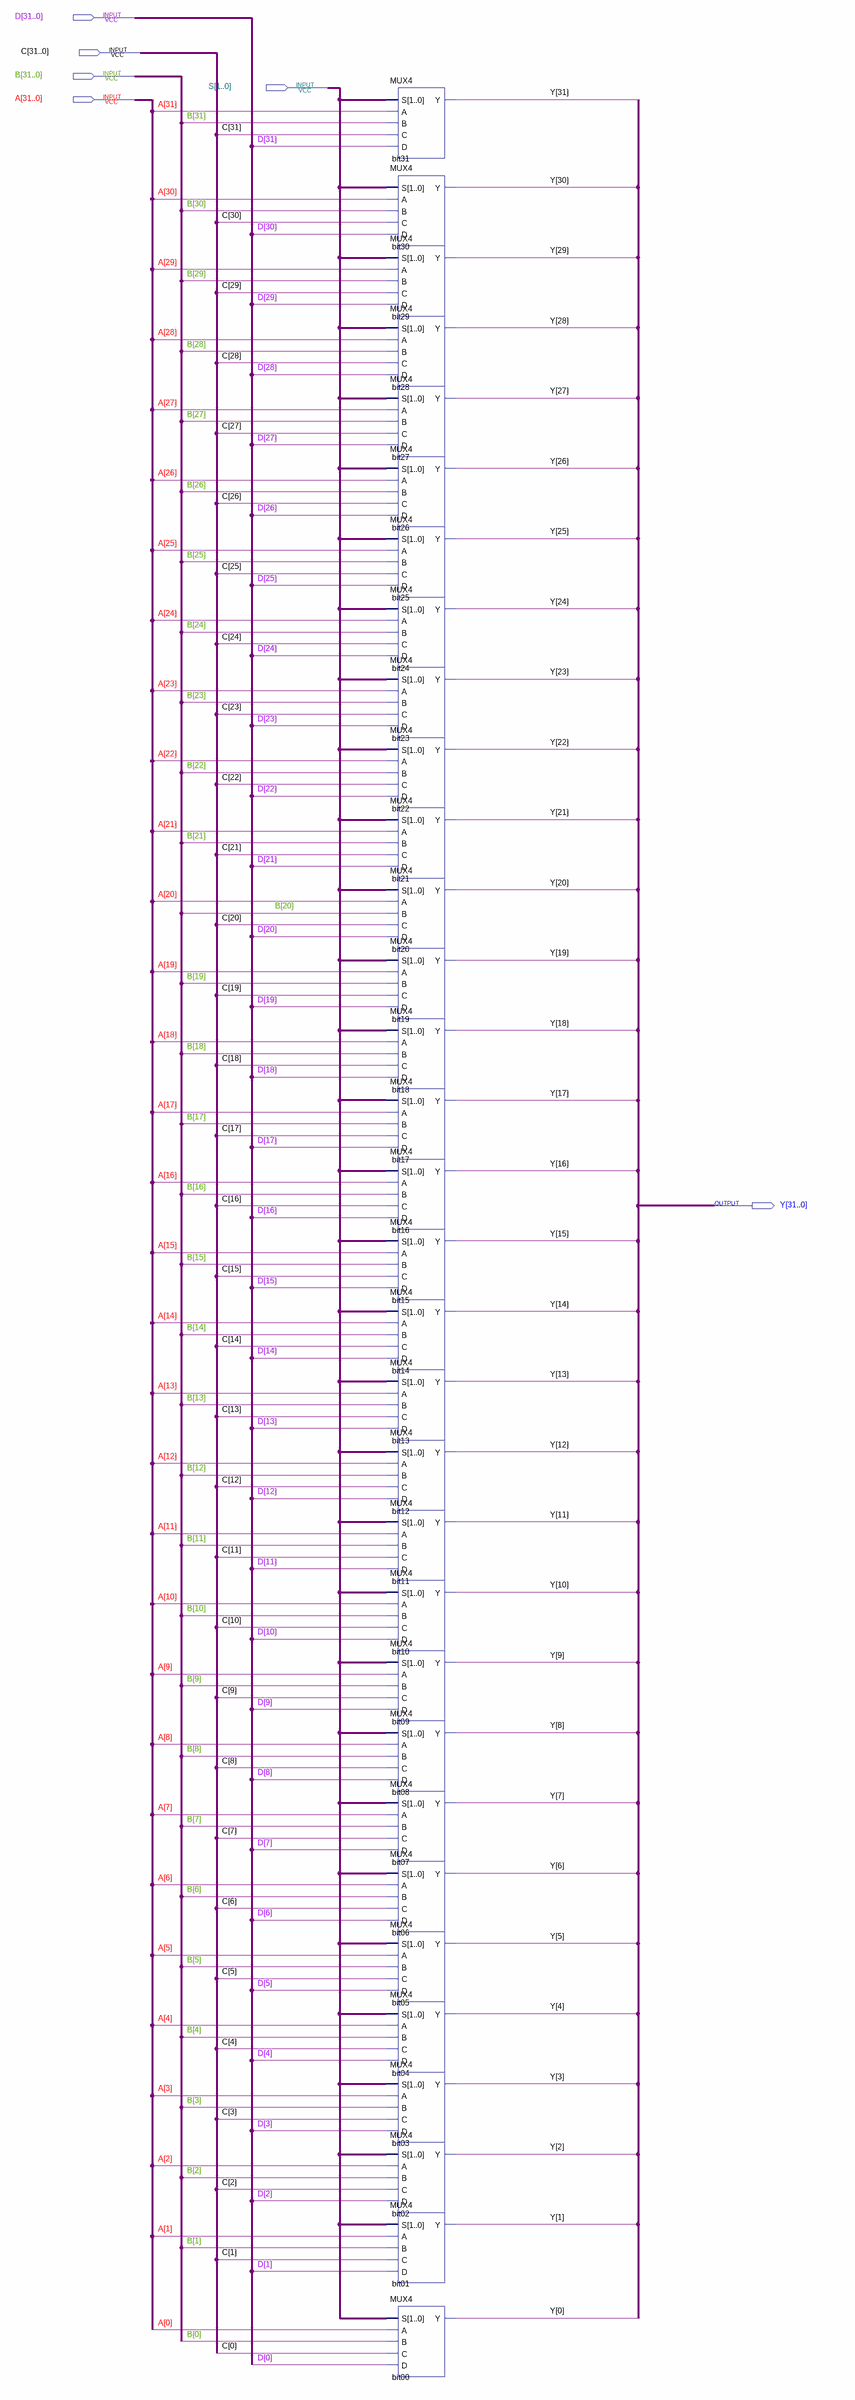
[diagram p0: schematic sheet]
// Quartus schematic MUX4_32.bdf as structural Verilog: 32 symbols, 6 pins
module MUX4_32 (
  input  [31:0] D,
  input  [31:0] C,
  input  [31:0] B,
  input  [1:0] S,
  input  [31:0] A,
  output [31:0] Y
);

  MUX4 bit31 (.S(S), .A(A[31]), .B(B[31]), .C(C[31]), .D(D[31]), .Y(Y[31]));
  MUX4 bit30 (.S(S), .A(A[30]), .B(B[30]), .C(C[30]), .D(D[30]), .Y(Y[30]));
  MUX4 bit29 (.S(S), .A(A[29]), .B(B[29]), .C(C[29]), .D(D[29]), .Y(Y[29]));
  MUX4 bit28 (.S(S), .A(A[28]), .B(B[28]), .C(C[28]), .D(D[28]), .Y(Y[28]));
  MUX4 bit27 (.S(S), .A(A[27]), .B(B[27]), .C(C[27]), .D(D[27]), .Y(Y[27]));
  MUX4 bit26 (.S(S), .A(A[26]), .B(B[26]), .C(C[26]), .D(D[26]), .Y(Y[26]));
  MUX4 bit25 (.S(S), .A(A[25]), .B(B[25]), .C(C[25]), .D(D[25]), .Y(Y[25]));
  MUX4 bit24 (.S(S), .A(A[24]), .B(B[24]), .C(C[24]), .D(D[24]), .Y(Y[24]));
  MUX4 bit23 (.S(S), .A(A[23]), .B(B[23]), .C(C[23]), .D(D[23]), .Y(Y[23]));
  MUX4 bit22 (.S(S), .A(A[22]), .B(B[22]), .C(C[22]), .D(D[22]), .Y(Y[22]));
  MUX4 bit21 (.S(S), .A(A[21]), .B(B[21]), .C(C[21]), .D(D[21]), .Y(Y[21]));
  MUX4 bit20 (.S(S), .A(A[20]), .B(B[20]), .C(C[20]), .D(D[20]), .Y(Y[20]));
  MUX4 bit19 (.S(S), .A(A[19]), .B(B[19]), .C(C[19]), .D(D[19]), .Y(Y[19]));
  MUX4 bit18 (.S(S), .A(A[18]), .B(B[18]), .C(C[18]), .D(D[18]), .Y(Y[18]));
  MUX4 bit17 (.S(S), .A(A[17]), .B(B[17]), .C(C[17]), .D(D[17]), .Y(Y[17]));
  MUX4 bit16 (.S(S), .A(A[16]), .B(B[16]), .C(C[16]), .D(D[16]), .Y(Y[16]));
  MUX4 bit15 (.S(S), .A(A[15]), .B(B[15]), .C(C[15]), .D(D[15]), .Y(Y[15]));
  MUX4 bit14 (.S(S), .A(A[14]), .B(B[14]), .C(C[14]), .D(D[14]), .Y(Y[14]));
  MUX4 bit13 (.S(S), .A(A[13]), .B(B[13]), .C(C[13]), .D(D[13]), .Y(Y[13]));
  MUX4 bit12 (.S(S), .A(A[12]), .B(B[12]), .C(C[12]), .D(D[12]), .Y(Y[12]));
  MUX4 bit11 (.S(S), .A(A[11]), .B(B[11]), .C(C[11]), .D(D[11]), .Y(Y[11]));
  MUX4 bit10 (.S(S), .A(A[10]), .B(B[10]), .C(C[10]), .D(D[10]), .Y(Y[10]));
  MUX4 bit09 (.S(S), .A(A[9]), .B(B[9]), .C(C[9]), .D(D[9]), .Y(Y[9]));
  MUX4 bit08 (.S(S), .A(A[8]), .B(B[8]), .C(C[8]), .D(D[8]), .Y(Y[8]));
  MUX4 bit07 (.S(S), .A(A[7]), .B(B[7]), .C(C[7]), .D(D[7]), .Y(Y[7]));
  MUX4 bit06 (.S(S), .A(A[6]), .B(B[6]), .C(C[6]), .D(D[6]), .Y(Y[6]));
  MUX4 bit05 (.S(S), .A(A[5]), .B(B[5]), .C(C[5]), .D(D[5]), .Y(Y[5]));
  MUX4 bit04 (.S(S), .A(A[4]), .B(B[4]), .C(C[4]), .D(D[4]), .Y(Y[4]));
  MUX4 bit03 (.S(S), .A(A[3]), .B(B[3]), .C(C[3]), .D(D[3]), .Y(Y[3]));
  MUX4 bit02 (.S(S), .A(A[2]), .B(B[2]), .C(C[2]), .D(D[2]), .Y(Y[2]));
  MUX4 bit01 (.S(S), .A(A[1]), .B(B[1]), .C(C[1]), .D(D[1]), .Y(Y[1]));
  MUX4 bit00 (.S(S), .A(A[0]), .B(B[0]), .C(C[0]), .D(D[0]), .Y(Y[0]));
endmodule
